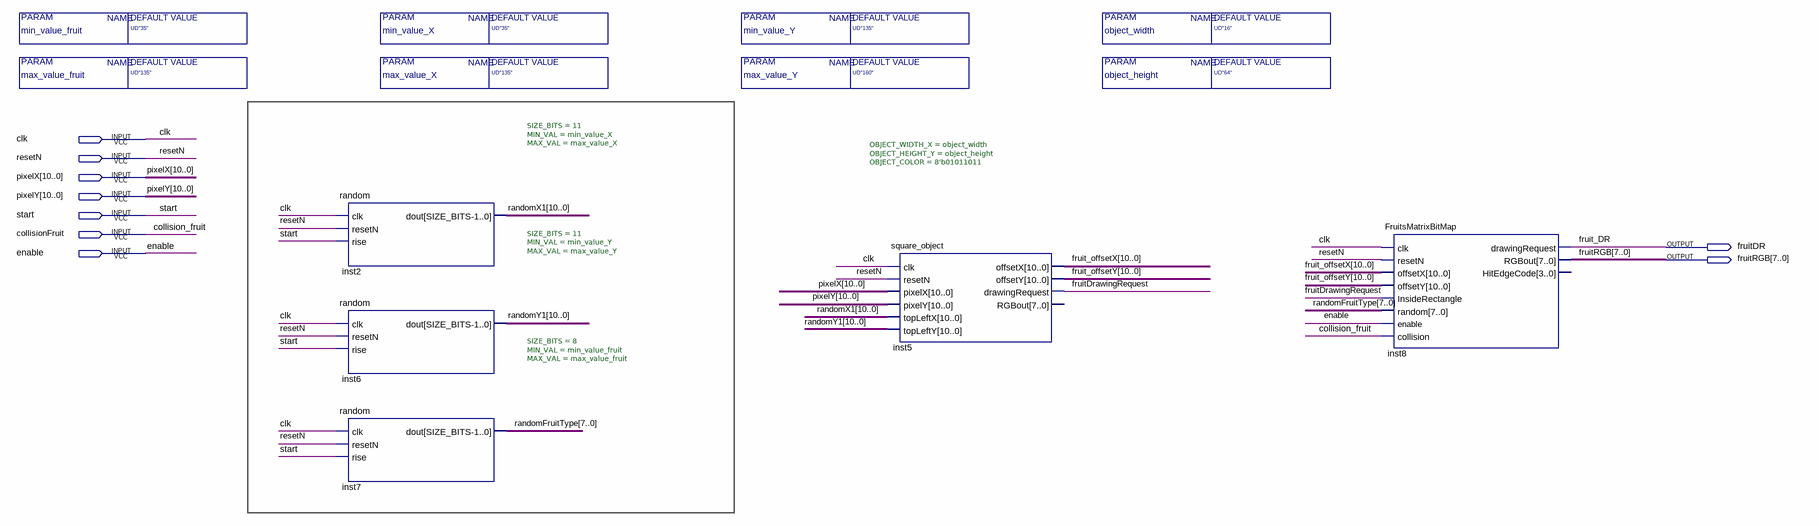
[diagram p0: schematic sheet]
// Quartus schematic freeFruitDraw.bdf as structural Verilog: 5 symbols, 9 pins
module freeFruitDraw #(parameter object_width = "UD\"16\"", parameter object_height = "UD\"64\"", parameter min_value_X = "UD\"35\"", parameter max_value_X = "UD\"135\"", parameter min_value_Y = "UD\"135\"", parameter max_value_Y = "UD\"160\"", parameter min_value_fruit = "UD\"35\"", parameter max_value_fruit = "UD\"135\"") (
  input  clk,
  input  resetN,
  input  [10:0] pixelX,
  input  [10:0] pixelY,
  input  start,
  input  collisionFruit,
  input  enable,
  output fruitDR,
  output [7:0] fruitRGB
);

  wire fruitDrawingRequest;
  wire [7:0] randomFruitType;
  wire [10:0] fruit_offsetX, fruit_offsetY, randomX1, randomY1;

  random #(.SIZE_BITS(11), .MIN_VAL(min_value_X), .MAX_VAL(max_value_X)) inst2 (
    .clk(clk), .resetN(resetN), .rise(start), .dout(randomX1));
  random #(.SIZE_BITS(11), .MIN_VAL(min_value_Y), .MAX_VAL(max_value_Y)) inst6 (
    .clk(clk), .resetN(resetN), .rise(start), .dout(randomY1));
  random #(.SIZE_BITS(8), .MIN_VAL(min_value_fruit), .MAX_VAL(max_value_fruit)) inst7 (
    .clk(clk), .resetN(resetN), .rise(start), .dout(randomFruitType));
  square_object #(.OBJECT_WIDTH_X(object_width), .OBJECT_HEIGHT_Y(object_height), .OBJECT_COLOR(8'b01011011)) inst5 (
    .clk(clk), .resetN(resetN), .pixelX(pixelX), .pixelY(pixelY), .topLeftX(randomX1), .topLeftY(randomY1),
    .offsetX(fruit_offsetX), .offsetY(fruit_offsetY), .drawingRequest(fruitDrawingRequest));  // open: RGBout
  FruitsMatrixBitMap inst8 (
    .clk(clk), .resetN(resetN), .offsetX(fruit_offsetX), .offsetY(fruit_offsetY),
    .InsideRectangle(fruitDrawingRequest), .random(randomFruitType), .enable(enable),
    .collision(collisionFruit), .drawingRequest(fruitDR), .RGBout(fruitRGB));  // open: HitEdgeCode

  // Other names for the same wires on the sheet: collision_fruit = collisionFruit; fruit_DR = fruitDR
endmodule
